# EAGLE design Keypad (EAGLE 7.6.0)
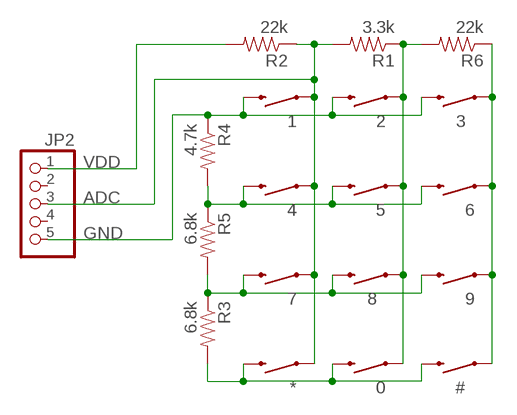
[diagram p0: schematic, sheet 1]

## Parts
0  SWITCH-MOMENTARY-2PTH  [TACTILE-PTH]
1  SWITCH-MOMENTARY-2PTH  [TACTILE-PTH]
2  SWITCH-MOMENTARY-2PTH  [TACTILE-PTH]
3  SWITCH-MOMENTARY-2PTH  [TACTILE-PTH]
4  SWITCH-MOMENTARY-2PTH  [TACTILE-PTH]
5  SWITCH-MOMENTARY-2PTH  [TACTILE-PTH]
6  SWITCH-MOMENTARY-2PTH  [TACTILE-PTH]
7  SWITCH-MOMENTARY-2PTH  [TACTILE-PTH]
8  SWITCH-MOMENTARY-2PTH  [TACTILE-PTH]
9  SWITCH-MOMENTARY-2PTH  [TACTILE-PTH]
#  SWITCH-MOMENTARY-2PTH  [TACTILE-PTH]
*  SWITCH-MOMENTARY-2PTH  [TACTILE-PTH]
JP2  HEADER-1X5ROUND  [1X05_ROUND]
R1  3.3k  0.3OHM-1/8W-1%(0805)  [0805]
R2  22k  0.3OHM-1/8W-1%(0805)  [0805]
R3  6.8k  0.3OHM-1/8W-1%(0805)  [0805]
R4  4.7k  0.3OHM-1/8W-1%(0805)  [0805]
R5  6.8k  0.3OHM-1/8W-1%(0805)  [0805]
R6  22k  0.3OHM-1/8W-1%(0805)  [0805]

## Nets
ADC: 1.1 4.1 7.1 *.1 JP2.3 R1.2 R2.1
GND: 1.3 2.3 3.3 JP2.5 R4.1
N$4: 0.3 #.3 *.3 R3.2
N$6: 4.3 5.3 6.3 R4.2 R5.1
N$7: 7.3 8.3 9.3 R3.1 R5.2
N$12: 0.1 2.1 5.1 8.1 R1.1 R6.2
N$13: 3.1 6.1 9.1 #.1 R6.1
VDD: JP2.1 R2.2
Unconnected: JP2.2 JP2.4

## Library data of the parts
0 1-9 # * = SparkFun-Electromechanical:SWITCH-MOMENTARY-2: Various NO switches- pushbuttons, reed, etc; PROD_ID: SWCH-08441
JP2 = microbuilder:HEADER-1X5: PIN HEADER
R1-R6 = SparkFun-Resistors:0.3OHM-1/8W-1%(0805): RES-11622; PROD_ID: RES-11622; VALUE: 0.3

## Board
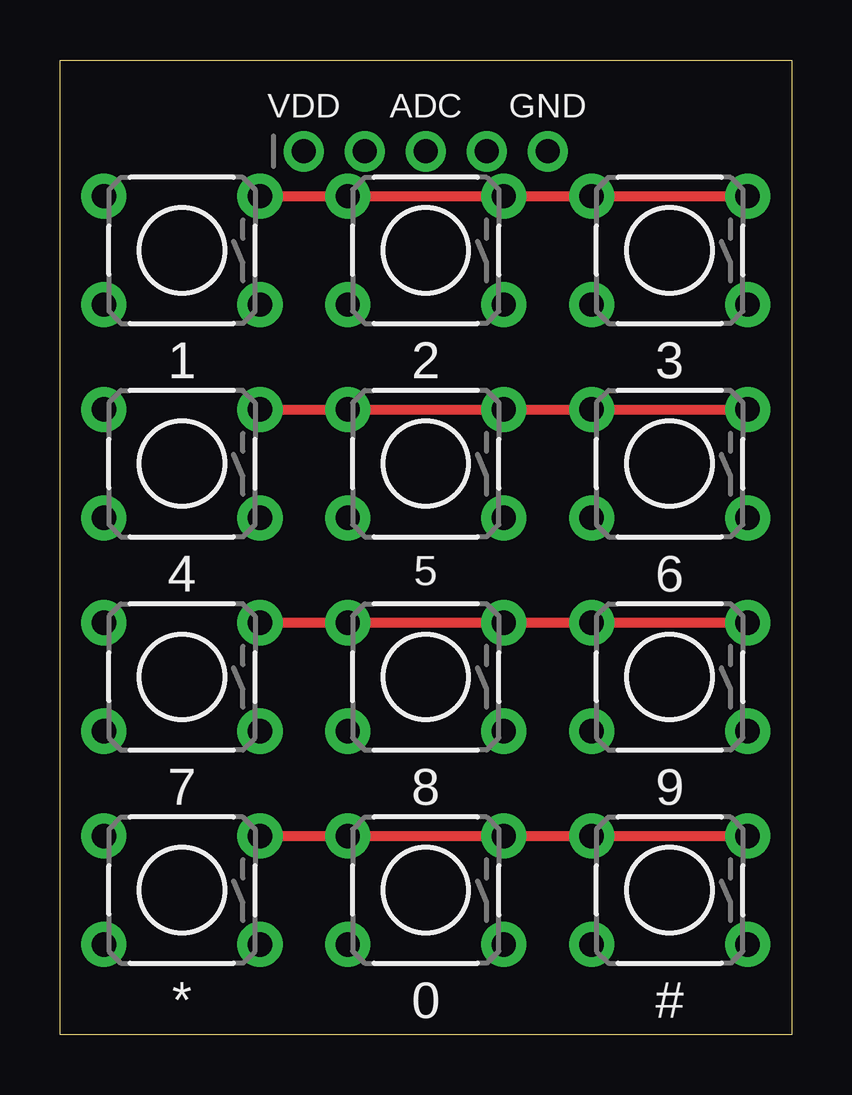
[diagram p1: board, top side]
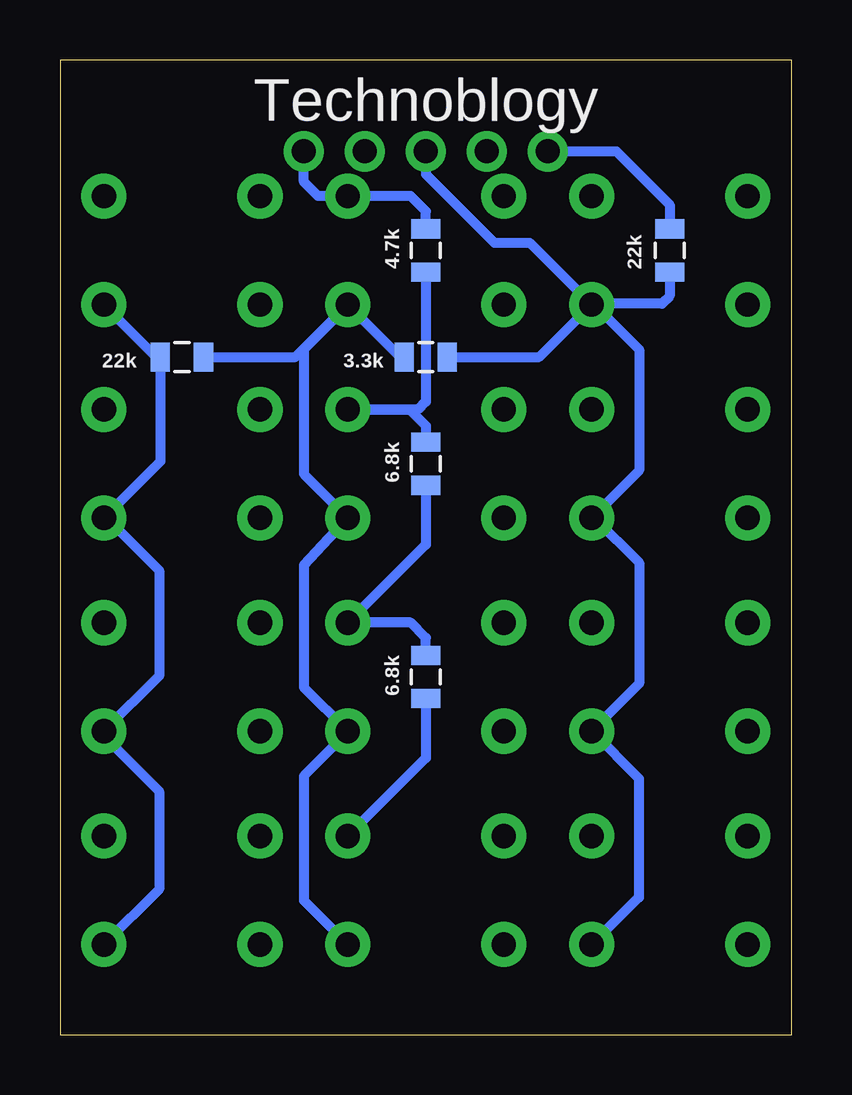
[diagram p2: board, bottom side, seen from below]

Size 30.48 x 40.64 mm. Coordinates in mm from the lower left corner, seen from the top.
Outline: 0,0 0,40.64 30.48,40.64 30.48,0 0,0
Copper layers (1*16): Top 0.035mm / dielectric 1.5mm / Bottom 0.035mm
Design rules "default": minimum track width 10mil, minimum drill 24mil, track to track 8mil, track to pad 8mil, pad to pad 8mil, via to via 8mil, smd to smd 8mil, copper to edge 40mil, drill to drill 8mil, minimum pad ring 10mil, minimum via ring 8mil, stop-mask expansion 4mil, vias tented up to drill 0mil, thermal gap 10mil

### Footprints (pad centres in the part's own frame; a part is rotated, then mirrored left to right if it is on the bottom)
TACTILE-PTH = drill 1.016 pad 1.88: 1 -3.251,2.261; 2 3.251,2.261; 3 -3.251,-2.261; 4 3.251,-2.261
1X05_ROUND = drill 1 pad 1.676: 1 -5.08,0; 2 -2.54,0; 3 0,0; 4 2.54,0; 5 5.08,0
0805 = smd 0.8 x 1.2: 1 -0.9,0; 2 0.9,0

### Placement (x,y rotation side)
0  15.24,6.03 180 top
1  5.08,32.7 180 top
2  15.24,32.7 180 top
3  25.4,32.7 180 top
4  5.08,23.81 180 top
5  15.24,23.81 180 top
6  25.4,23.81 180 top
7  5.08,14.92 180 top
8  15.24,14.92 180 top
9  25.4,14.92 180 top
#  25.4,6.03 180 top
*  5.08,6.03 180 top
JP2  15.24,36.83 0 top
R1  15.24,28.26 0 bottom
R2  5.08,32.7 90 bottom
R3  15.24,14.92 270 bottom
R4  15.24,32.7 270 bottom
R5  15.24,23.81 270 bottom
R6  25.4,28.26 0 bottom

### Tracks (layer width: path | path; a pad name or v marks a point on that pad's centre or on a via)
ADC
  Bottom 0.406: 1.1 10.52,28.26 R1.2 14.29,28.31 | *.1 6.39,5.71 6.35,5.71 6.35,10.68 7.1 6.35,14.64 6.35,19.68 8.22,21.55 4.1 6.35,23.53 6.35,28.57 8.22,30.44 1.1 | JP2.3 15.24,35.88 12.38,33.02 10.91,33.02 1.1 | R2.1 5.08,30.8 5.4,30.48 8.29,30.48 1.1
GND
  Top 0.406: 1.3 2.3 3.3
  Bottom 0.406: JP2.5 20.32,35.56 19.72,34.96 2.3 15.87,34.96 15.24,34.33 R4.1
N$4
  Top 0.406: #.3 19.05,8.29 0.3 *.3
  Bottom 0.406: R3.2 15.24,11.54 0.3
N$6
  Top 0.406: 4.3 5.3 6.3
  Bottom 0.406: R5.1 15.24,25.4 15.91,26.07 5.3 15.56,26.07 15.24,26.39 R4.2
N$7
  Top 0.406: 7.3 8.3 9.3
  Bottom 0.406: R5.2 15.24,20.43 8.3 15.87,17.18 15.24,16.55 R3.1
N$12
  Bottom 0.406: 2.1 18.49,30.4 20.32,28.57 20.32,23.38 5.1 20.32,19.57 20.32,14.49 8.1 18.49,12.62 20.32,10.79 20.32,5.6 0.1 | R6.2 20.68,28.26 2.1 | R1.1 16.31,28.26 2.1
N$13
  Bottom 0.406: 3.1 26.47,28.26 R6.1 26.3,23.9 6.1 28.54,21.55 | 28.54,21.55 26.35,19.37 26.35,14.96 9.1 28.65,12.46 26.35,10.16 26.35,6.07 #.1 | 28.54,21.55 28.54,21.63
VDD
  Bottom 0.406: JP2.1 7.3,36.83 5.08,34.61 R2.2

### Text on the board
tPlace: VDD | ADC | GND
bPlace: Technoblogy